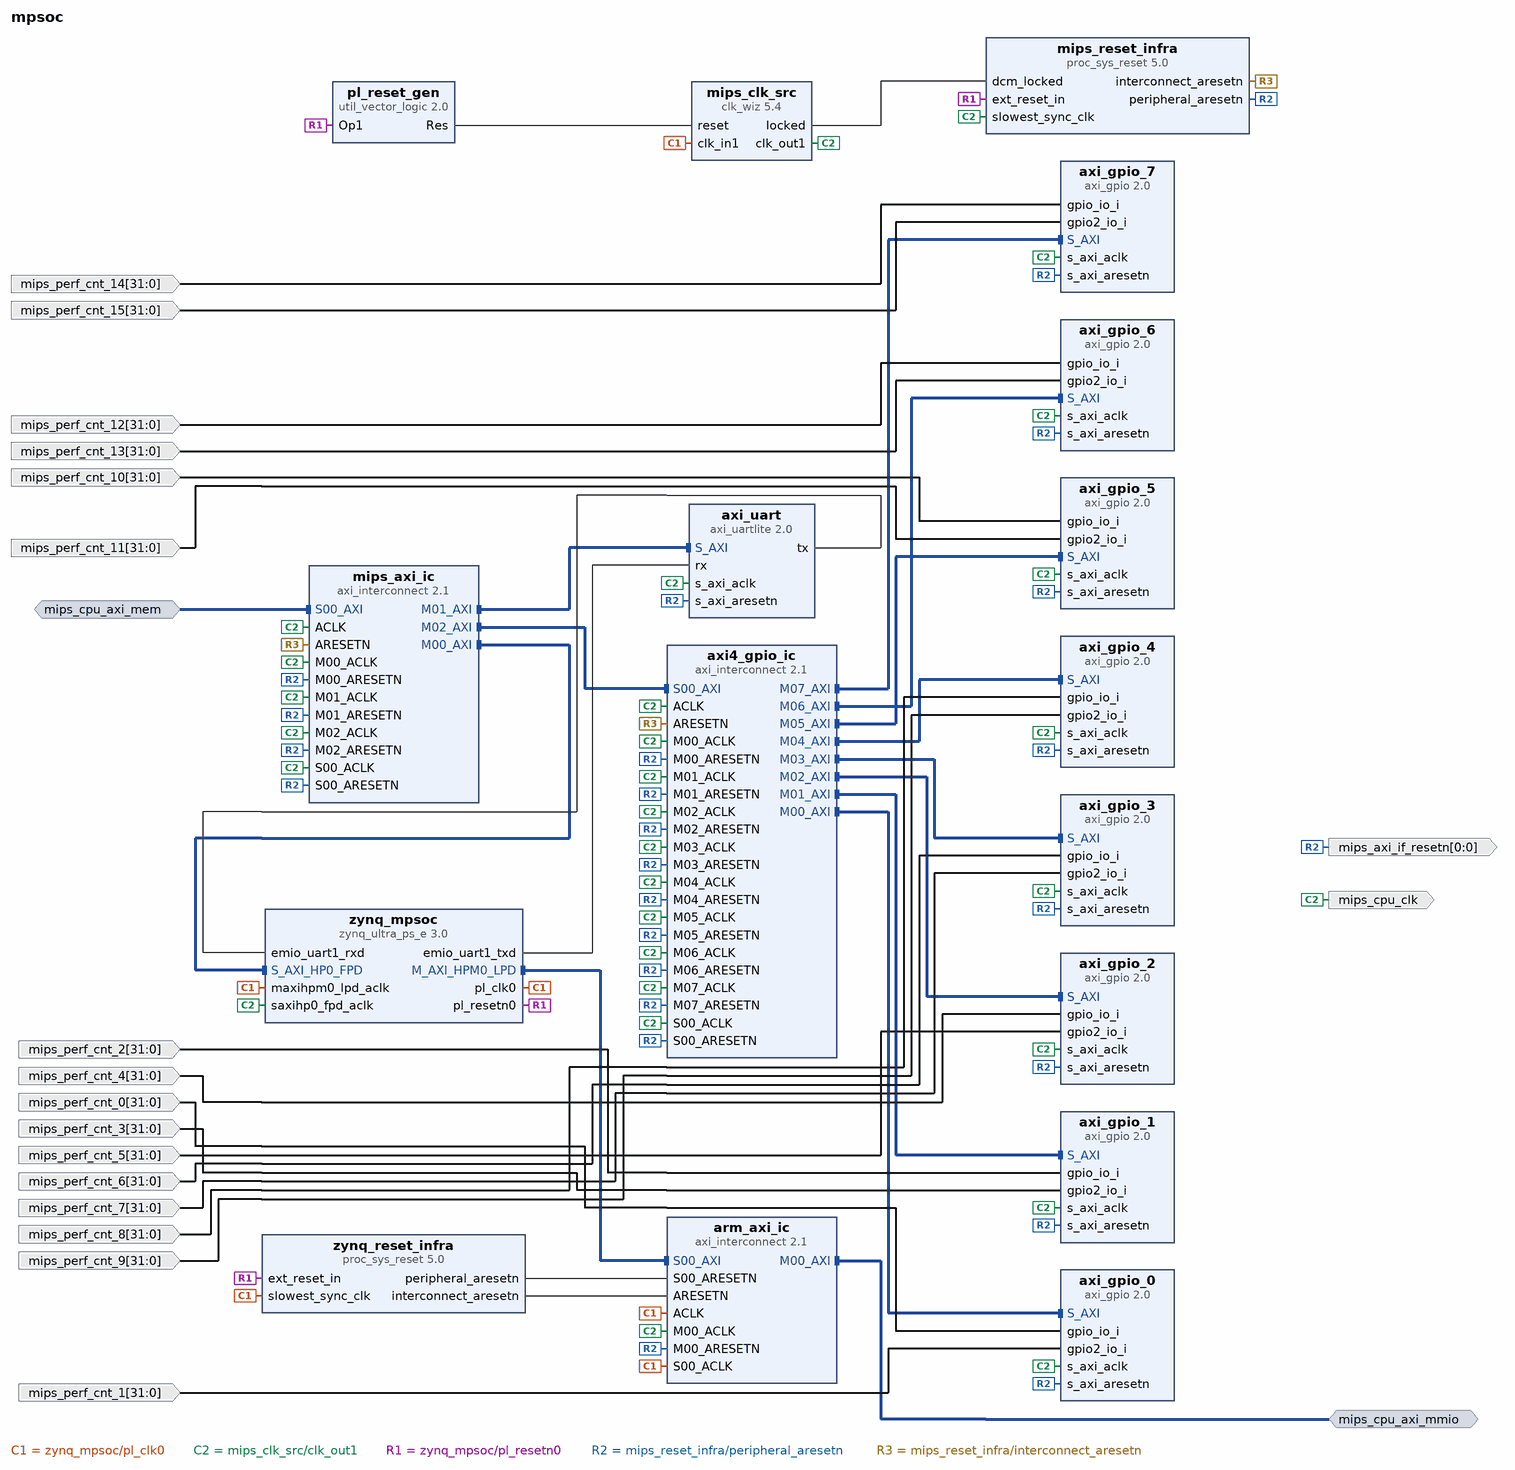
[diagram p0: block diagram of the top level]
# Vivado block design mpsoc, xczu2eg-sfva625-1-e, Vivado 2017.2
create_bd_design mpsoc

create_bd_intf_port -mode Master -vlnv xilinx.com:interface:aximm_rtl:1.0 mips_cpu_axi_mmio
set_property -dict {CONFIG.DATA_WIDTH 32 CONFIG.PROTOCOL AXI4LITE CONFIG.ADDR_WIDTH 32} [get_bd_intf_ports mips_cpu_axi_mmio]
create_bd_intf_port -mode Slave -vlnv xilinx.com:interface:aximm_rtl:1.0 mips_cpu_axi_mem
set_property -dict [list \
  CONFIG.DATA_WIDTH 32 \
  CONFIG.PROTOCOL AXI4LITE \
  CONFIG.ID_WIDTH 0 \
  CONFIG.ADDR_WIDTH 32 \
  CONFIG.AWUSER_WIDTH 0 \
  CONFIG.ARUSER_WIDTH 0 \
  CONFIG.WUSER_WIDTH 0 \
  CONFIG.RUSER_WIDTH 0 \
  CONFIG.BUSER_WIDTH 0 \
  CONFIG.READ_WRITE_MODE READ_WRITE \
  CONFIG.HAS_BURST 1 \
  CONFIG.HAS_LOCK 1 \
  CONFIG.HAS_PROT 1 \
  CONFIG.HAS_CACHE 1 \
  CONFIG.HAS_QOS 1 \
  CONFIG.HAS_REGION 1 \
  CONFIG.HAS_WSTRB 1 \
  CONFIG.HAS_BRESP 1 \
  CONFIG.HAS_RRESP 1 \
  CONFIG.SUPPORTS_NARROW_BURST 0 \
  CONFIG.NUM_READ_OUTSTANDING 1 \
  CONFIG.NUM_WRITE_OUTSTANDING 1 \
  CONFIG.MAX_BURST_LENGTH 1 \
  CONFIG.NUM_READ_THREADS 1 \
  CONFIG.NUM_WRITE_THREADS 1 \
  CONFIG.RUSER_BITS_PER_BYTE 0 \
  CONFIG.WUSER_BITS_PER_BYTE 0 \
] [get_bd_intf_ports mips_cpu_axi_mem]
create_bd_port -dir O -type clk mips_cpu_clk
set_property -dict {CONFIG.ASSOCIATED_BUSIF mips_cpu_axi_mmio:mips_cpu_axi_mem} [get_bd_ports mips_cpu_clk]
create_bd_port -dir O -from 0 -to 0 -type rst mips_axi_if_resetn
create_bd_port -dir I -from 31 -to 0 mips_perf_cnt_0
create_bd_port -dir I -from 31 -to 0 mips_perf_cnt_1
create_bd_port -dir I -from 31 -to 0 mips_perf_cnt_2
create_bd_port -dir I -from 31 -to 0 mips_perf_cnt_3
create_bd_port -dir I -from 31 -to 0 mips_perf_cnt_4
create_bd_port -dir I -from 31 -to 0 mips_perf_cnt_5
create_bd_port -dir I -from 31 -to 0 mips_perf_cnt_6
create_bd_port -dir I -from 31 -to 0 mips_perf_cnt_7
create_bd_port -dir I -from 31 -to 0 mips_perf_cnt_8
create_bd_port -dir I -from 31 -to 0 mips_perf_cnt_9
create_bd_port -dir I -from 31 -to 0 mips_perf_cnt_10
create_bd_port -dir I -from 31 -to 0 mips_perf_cnt_11
create_bd_port -dir I -from 31 -to 0 mips_perf_cnt_12
create_bd_port -dir I -from 31 -to 0 mips_perf_cnt_13
create_bd_port -dir I -from 31 -to 0 mips_perf_cnt_14
create_bd_port -dir I -from 31 -to 0 mips_perf_cnt_15

create_bd_cell -type ip -vlnv xilinx.com:ip:zynq_ultra_ps_e:3.0 zynq_mpsoc
set_property -dict [list \
  CONFIG.PSU__CAN1__PERIPHERAL__ENABLE 1 \
  CONFIG.PSU__CAN1__PERIPHERAL__IO {MIO 24 .. 25} \
  CONFIG.PSU__DPAUX__PERIPHERAL__IO {MIO 27 .. 30} \
  CONFIG.PSU__ENET3__PERIPHERAL__ENABLE 1 \
  CONFIG.PSU__ENET3__GRP_MDIO__ENABLE 1 \
  CONFIG.PSU__GPIO0_MIO__PERIPHERAL__ENABLE 1 \
  CONFIG.PSU__GPIO0_MIO__IO {MIO 0 .. 25} \
  CONFIG.PSU__GPIO1_MIO__PERIPHERAL__ENABLE 1 \
  CONFIG.PSU__GPIO1_MIO__IO {MIO 26 .. 51} \
  CONFIG.PSU__GPIO2_MIO__PERIPHERAL__ENABLE 1 \
  CONFIG.PSU__GPIO2_MIO__IO {MIO 52 .. 77} \
  CONFIG.PSU__I2C0__PERIPHERAL__ENABLE 1 \
  CONFIG.PSU__I2C0__PERIPHERAL__IO {MIO 14 .. 15} \
  CONFIG.PSU__I2C1__PERIPHERAL__ENABLE 1 \
  CONFIG.PSU__I2C1__PERIPHERAL__IO {MIO 16 .. 17} \
  CONFIG.PSU__PCIE__PERIPHERAL__ENABLE 1 \
  CONFIG.PSU__PCIE__PERIPHERAL__ROOTPORT_IO {MIO 31} \
  CONFIG.PSU__USB0__REF_CLK_SEL {Ref Clk2} \
  CONFIG.PSU__DP__REF_CLK_SEL {Ref Clk3} \
  CONFIG.PSU__SATA__REF_CLK_SEL {Ref Clk1} \
  CONFIG.PSU__SATA__REF_CLK_FREQ 125 \
  CONFIG.PSU__DP__LANE_SEL {Single Lower} \
  CONFIG.PSU__PCIE__DEVICE_PORT_TYPE {Root Port} \
  CONFIG.PSU__PCIE__DEVICE_ID 0xD021 \
  CONFIG.PSU__PCIE__CLASS_CODE_SUB 0x4 \
  CONFIG.PSU__QSPI__PERIPHERAL__ENABLE 1 \
  CONFIG.PSU__QSPI__PERIPHERAL__IO {MIO 0 .. 12} \
  CONFIG.PSU__QSPI__PERIPHERAL__MODE {Dual Parallel} \
  CONFIG.PSU__QSPI__PERIPHERAL__DATA_MODE x4 \
  CONFIG.PSU__QSPI__GRP_FBCLK__ENABLE 1 \
  CONFIG.PSU__SD1__PERIPHERAL__ENABLE 1 \
  CONFIG.PSU__SD1__PERIPHERAL__IO {MIO 46 .. 51} \
  CONFIG.PSU__SD1__GRP_CD__ENABLE 1 \
  CONFIG.PSU__SD1__GRP_CD__IO {MIO 45} \
  CONFIG.PSU__SD1__GRP_POW__ENABLE 0 \
  CONFIG.PSU__SD1__GRP_WP__ENABLE 1 \
  CONFIG.PSU__SD1__SLOT_TYPE {SD 2.0} \
  CONFIG.PSU__SD1__DATA_TRANSFER_MODE 4Bit \
  CONFIG.PSU__UART0__BAUD_RATE 115200 \
  CONFIG.PSU__TTC0__PERIPHERAL__ENABLE 1 \
  CONFIG.PSU__TTC1__PERIPHERAL__ENABLE 1 \
  CONFIG.PSU__TTC2__PERIPHERAL__ENABLE 1 \
  CONFIG.PSU__TTC3__PERIPHERAL__ENABLE 1 \
  CONFIG.PSU__CSUPMU__PERIPHERAL__VALID 0 \
  CONFIG.PSU__DDRC__DEVICE_CAPACITY {8192 MBits} \
  CONFIG.PSU__DDRC__DRAM_WIDTH {16 Bits} \
  CONFIG.PSU__DDRC__SPEED_BIN DDR4_2133P \
  CONFIG.PSU__UART0__PERIPHERAL__ENABLE 1 \
  CONFIG.PSU__UART0__PERIPHERAL__IO {MIO 34 .. 35} \
  CONFIG.PSU__UART1__PERIPHERAL__ENABLE 1 \
  CONFIG.PSU__UART1__PERIPHERAL__IO EMIO \
  CONFIG.PSU__USB0__PERIPHERAL__ENABLE 1 \
  CONFIG.PSU__USB3_0__PERIPHERAL__ENABLE 1 \
  CONFIG.PSU__USB3_0__PERIPHERAL__IO {GT Lane2} \
  CONFIG.PSU__USB2_0__EMIO__ENABLE 0 \
  CONFIG.PSU__USE__S_AXI_GP2 1 \
  CONFIG.PSU__SAXIGP2__DATA_WIDTH 64 \
  CONFIG.PSU_BANK_0_IO_STANDARD LVCMOS18 \
  CONFIG.PSU_BANK_2_IO_STANDARD LVCMOS18 \
  CONFIG.PSU_BANK_3_IO_STANDARD LVCMOS33 \
  CONFIG.PSU__DISPLAYPORT__PERIPHERAL__ENABLE 1 \
  CONFIG.PSU__SATA__PERIPHERAL__ENABLE 1 \
  CONFIG.PSU__SATA__LANE1__IO {GT Lane3} \
  CONFIG.PSU__CRF_APB__DP_VIDEO_REF_CTRL__SRCSEL VPLL \
  CONFIG.PSU__CRF_APB__DP_AUDIO_REF_CTRL__SRCSEL RPLL \
  CONFIG.PSU__CRF_APB__DP_STC_REF_CTRL__SRCSEL RPLL \
  CONFIG.PSU__CRF_APB__GPU_REF_CTRL__SRCSEL IOPLL \
  CONFIG.PSU__CRF_APB__GDMA_REF_CTRL__SRCSEL APLL \
  CONFIG.PSU__CRF_APB__DPDMA_REF_CTRL__SRCSEL APLL \
  CONFIG.PSU__CRF_APB__TOPSW_MAIN_CTRL__SRCSEL DPLL \
  CONFIG.PSU__CRL_APB__IOU_SWITCH_CTRL__SRCSEL IOPLL \
  CONFIG.PSU__CRL_APB__TIMESTAMP_REF_CTRL__SRCSEL IOPLL \
  CONFIG.PSU__DLL__ISUSED 1 \
  CONFIG.PSU__DDR__INTERFACE__FREQMHZ 533.500 \
  CONFIG.PSU__CRF_APB__ACPU_CTRL__FREQMHZ 1200 \
  CONFIG.PSU__CRF_APB__DDR_CTRL__FREQMHZ 1067 \
  CONFIG.PSU__CRF_APB__GPU_REF_CTRL__FREQMHZ 500 \
  CONFIG.PSU__CRF_APB__GDMA_REF_CTRL__FREQMHZ 600 \
  CONFIG.PSU__CRF_APB__DPDMA_REF_CTRL__FREQMHZ 600 \
  CONFIG.PSU__CRF_APB__TOPSW_MAIN_CTRL__FREQMHZ 533.33 \
  CONFIG.PSU__CRL_APB__QSPI_REF_CTRL__FREQMHZ 125 \
  CONFIG.PSU__CRL_APB__IOU_SWITCH_CTRL__FREQMHZ 250 \
  CONFIG.PSU__CRL_APB__AMS_REF_CTRL__FREQMHZ 52 \
] [get_bd_cells zynq_mpsoc]
# 26 more settings of zynq_mpsoc are not shown: defaults, MIO pin electricals, DDR timing, and values the tool derives
create_bd_cell -type ip -vlnv xilinx.com:ip:axi_interconnect:2.1 arm_axi_ic
set_property -dict {CONFIG.NUM_SI 1 CONFIG.NUM_MI 1} [get_bd_cells arm_axi_ic]
create_bd_cell -type ip -vlnv xilinx.com:ip:axi_interconnect:2.1 mips_axi_ic
set_property -dict {CONFIG.NUM_SI 1 CONFIG.NUM_MI 3} [get_bd_cells mips_axi_ic]
create_bd_cell -type ip -vlnv xilinx.com:ip:proc_sys_reset:5.0 zynq_reset_infra
create_bd_cell -type ip -vlnv xilinx.com:ip:proc_sys_reset:5.0 mips_reset_infra
create_bd_cell -type ip -vlnv xilinx.com:ip:clk_wiz:5.4 mips_clk_src
set_property -dict {CONFIG.JITTER_OPTIONS PS CONFIG.CLKOUT1_REQUESTED_OUT_FREQ 190} [get_bd_cells mips_clk_src]
create_bd_cell -type ip -vlnv xilinx.com:ip:axi_uartlite:2.0 axi_uart
set_property -dict {CONFIG.C_BAUDRATE 115200} [get_bd_cells axi_uart]
create_bd_cell -type ip -vlnv xilinx.com:ip:axi_gpio:2.0 axi_gpio_0
set_property -dict [list \
  CONFIG.C_GPIO_WIDTH 32 \
  CONFIG.C_GPIO2_WIDTH 32 \
  CONFIG.C_IS_DUAL 1 \
  CONFIG.C_ALL_INPUTS 1 \
  CONFIG.C_ALL_INPUTS_2 1 \
] [get_bd_cells axi_gpio_0]
create_bd_cell -type ip -vlnv xilinx.com:ip:axi_gpio:2.0 axi_gpio_1
set_property -dict [list \
  CONFIG.C_GPIO_WIDTH 32 \
  CONFIG.C_GPIO2_WIDTH 32 \
  CONFIG.C_IS_DUAL 1 \
  CONFIG.C_ALL_INPUTS 1 \
  CONFIG.C_ALL_INPUTS_2 1 \
] [get_bd_cells axi_gpio_1]
create_bd_cell -type ip -vlnv xilinx.com:ip:axi_gpio:2.0 axi_gpio_2
set_property -dict [list \
  CONFIG.C_GPIO_WIDTH 32 \
  CONFIG.C_GPIO2_WIDTH 32 \
  CONFIG.C_IS_DUAL 1 \
  CONFIG.C_ALL_INPUTS 1 \
  CONFIG.C_ALL_INPUTS_2 1 \
] [get_bd_cells axi_gpio_2]
create_bd_cell -type ip -vlnv xilinx.com:ip:axi_gpio:2.0 axi_gpio_3
set_property -dict [list \
  CONFIG.C_GPIO_WIDTH 32 \
  CONFIG.C_GPIO2_WIDTH 32 \
  CONFIG.C_IS_DUAL 1 \
  CONFIG.C_ALL_INPUTS 1 \
  CONFIG.C_ALL_INPUTS_2 1 \
] [get_bd_cells axi_gpio_3]
create_bd_cell -type ip -vlnv xilinx.com:ip:axi_gpio:2.0 axi_gpio_4
set_property -dict [list \
  CONFIG.C_GPIO_WIDTH 32 \
  CONFIG.C_GPIO2_WIDTH 32 \
  CONFIG.C_IS_DUAL 1 \
  CONFIG.C_ALL_INPUTS 1 \
  CONFIG.C_ALL_INPUTS_2 1 \
] [get_bd_cells axi_gpio_4]
create_bd_cell -type ip -vlnv xilinx.com:ip:axi_gpio:2.0 axi_gpio_5
set_property -dict [list \
  CONFIG.C_GPIO_WIDTH 32 \
  CONFIG.C_GPIO2_WIDTH 32 \
  CONFIG.C_IS_DUAL 1 \
  CONFIG.C_ALL_INPUTS 1 \
  CONFIG.C_ALL_INPUTS_2 1 \
] [get_bd_cells axi_gpio_5]
create_bd_cell -type ip -vlnv xilinx.com:ip:axi_gpio:2.0 axi_gpio_6
set_property -dict [list \
  CONFIG.C_GPIO_WIDTH 32 \
  CONFIG.C_GPIO2_WIDTH 32 \
  CONFIG.C_IS_DUAL 1 \
  CONFIG.C_ALL_INPUTS 1 \
  CONFIG.C_ALL_INPUTS_2 1 \
] [get_bd_cells axi_gpio_6]
create_bd_cell -type ip -vlnv xilinx.com:ip:axi_gpio:2.0 axi_gpio_7
set_property -dict [list \
  CONFIG.C_GPIO_WIDTH 32 \
  CONFIG.C_GPIO2_WIDTH 32 \
  CONFIG.C_IS_DUAL 1 \
  CONFIG.C_ALL_INPUTS 1 \
  CONFIG.C_ALL_INPUTS_2 1 \
] [get_bd_cells axi_gpio_7]
create_bd_cell -type ip -vlnv xilinx.com:ip:axi_interconnect:2.1 axi4_gpio_ic
set_property -dict {CONFIG.NUM_SI 1 CONFIG.NUM_MI 8} [get_bd_cells axi4_gpio_ic]
create_bd_cell -type ip -vlnv xilinx.com:ip:util_vector_logic:2.0 pl_reset_gen
set_property -dict {CONFIG.C_SIZE 1 CONFIG.C_OPERATION not} [get_bd_cells pl_reset_gen]

# ---- connections ----

connect_bd_intf_net -intf_net armv8_ps_M_AXI_GP0 [get_bd_intf_pins arm_axi_ic/S00_AXI] [get_bd_intf_pins zynq_mpsoc/M_AXI_HPM0_LPD]
connect_bd_intf_net -intf_net axi_ddr_if [get_bd_intf_pins mips_axi_ic/M00_AXI] [get_bd_intf_pins zynq_mpsoc/S_AXI_HP0_FPD]
connect_bd_intf_net [get_bd_intf_pins mips_axi_ic/M01_AXI] [get_bd_intf_pins axi_uart/S_AXI]
connect_bd_intf_net -intf_net axi_gpio_ic_s [get_bd_intf_pins mips_axi_ic/M02_AXI] [get_bd_intf_pins axi4_gpio_ic/S00_AXI]
connect_bd_intf_net -intf_net axi_gpio_ic_m_0 [get_bd_intf_pins axi4_gpio_ic/M00_AXI] [get_bd_intf_pins axi_gpio_0/S_AXI]
connect_bd_intf_net -intf_net axi_gpio_ic_m_1 [get_bd_intf_pins axi4_gpio_ic/M01_AXI] [get_bd_intf_pins axi_gpio_1/S_AXI]
connect_bd_intf_net -intf_net axi_gpio_ic_m_2 [get_bd_intf_pins axi4_gpio_ic/M02_AXI] [get_bd_intf_pins axi_gpio_2/S_AXI]
connect_bd_intf_net -intf_net axi_gpio_ic_m_3 [get_bd_intf_pins axi4_gpio_ic/M03_AXI] [get_bd_intf_pins axi_gpio_3/S_AXI]
connect_bd_intf_net -intf_net axi_gpio_ic_m_4 [get_bd_intf_pins axi4_gpio_ic/M04_AXI] [get_bd_intf_pins axi_gpio_4/S_AXI]
connect_bd_intf_net -intf_net axi_gpio_ic_m_5 [get_bd_intf_pins axi4_gpio_ic/M05_AXI] [get_bd_intf_pins axi_gpio_5/S_AXI]
connect_bd_intf_net -intf_net axi_gpio_ic_m_6 [get_bd_intf_pins axi4_gpio_ic/M06_AXI] [get_bd_intf_pins axi_gpio_6/S_AXI]
connect_bd_intf_net -intf_net axi_gpio_ic_m_7 [get_bd_intf_pins axi4_gpio_ic/M07_AXI] [get_bd_intf_pins axi_gpio_7/S_AXI]
connect_bd_intf_net -intf_net mips_cpu_slave [get_bd_intf_ports mips_cpu_axi_mmio] [get_bd_intf_pins arm_axi_ic/M00_AXI]
connect_bd_intf_net -intf_net mips_cpu_master [get_bd_intf_ports mips_cpu_axi_mem] [get_bd_intf_pins mips_axi_ic/S00_AXI]
connect_bd_net -net armv8_ps_fclk_0 [get_bd_pins zynq_mpsoc/pl_clk0] \
  [get_bd_pins mips_clk_src/clk_in1] [get_bd_pins zynq_mpsoc/maxihpm0_lpd_aclk] \
  [get_bd_pins zynq_reset_infra/slowest_sync_clk] [get_bd_pins arm_axi_ic/ACLK] [get_bd_pins arm_axi_ic/S00_ACLK]
connect_bd_net -net mips_clk [get_bd_pins mips_clk_src/clk_out1] \
  [get_bd_ports mips_cpu_clk] [get_bd_pins zynq_mpsoc/saxihp0_fpd_aclk] [get_bd_pins arm_axi_ic/M00_ACLK] \
  [get_bd_pins mips_axi_ic/S00_ACLK] [get_bd_pins mips_axi_ic/M00_ACLK] [get_bd_pins mips_axi_ic/M01_ACLK] \
  [get_bd_pins mips_axi_ic/M02_ACLK] [get_bd_pins mips_axi_ic/ACLK] [get_bd_pins axi_uart/s_axi_aclk] \
  [get_bd_pins mips_reset_infra/slowest_sync_clk] [get_bd_pins axi4_gpio_ic/ACLK] [get_bd_pins axi4_gpio_ic/M00_ACLK] \
  [get_bd_pins axi4_gpio_ic/M01_ACLK] [get_bd_pins axi4_gpio_ic/M02_ACLK] [get_bd_pins axi4_gpio_ic/M03_ACLK] \
  [get_bd_pins axi4_gpio_ic/M04_ACLK] [get_bd_pins axi4_gpio_ic/M05_ACLK] [get_bd_pins axi4_gpio_ic/M06_ACLK] \
  [get_bd_pins axi4_gpio_ic/M07_ACLK] [get_bd_pins axi4_gpio_ic/S00_ACLK] [get_bd_pins axi_gpio_0/s_axi_aclk] \
  [get_bd_pins axi_gpio_1/s_axi_aclk] [get_bd_pins axi_gpio_2/s_axi_aclk] [get_bd_pins axi_gpio_3/s_axi_aclk] \
  [get_bd_pins axi_gpio_4/s_axi_aclk] [get_bd_pins axi_gpio_5/s_axi_aclk] [get_bd_pins axi_gpio_6/s_axi_aclk] \
  [get_bd_pins axi_gpio_7/s_axi_aclk]
connect_bd_net -net ps_user_reset_n [get_bd_pins zynq_mpsoc/pl_resetn0] \
  [get_bd_pins zynq_reset_infra/ext_reset_in] [get_bd_pins mips_reset_infra/ext_reset_in] [get_bd_pins pl_reset_gen/Op1]
connect_bd_net -net pl_user_reset [get_bd_pins pl_reset_gen/Res] [get_bd_pins mips_clk_src/reset]
connect_bd_net -net zynq_perip_resetn [get_bd_pins zynq_reset_infra/peripheral_aresetn] [get_bd_pins arm_axi_ic/S00_ARESETN]
connect_bd_net -net zynq_ic_resetn [get_bd_pins zynq_reset_infra/interconnect_aresetn] [get_bd_pins arm_axi_ic/ARESETN]
connect_bd_net [get_bd_pins mips_clk_src/locked] [get_bd_pins mips_reset_infra/dcm_locked]
connect_bd_net -net mips_cpu_resetn [get_bd_pins mips_reset_infra/peripheral_aresetn] \
  [get_bd_pins mips_axi_ic/S00_ARESETN] [get_bd_pins mips_axi_ic/M00_ARESETN] [get_bd_pins mips_axi_ic/M01_ARESETN] \
  [get_bd_pins mips_axi_ic/M02_ARESETN] [get_bd_pins arm_axi_ic/M00_ARESETN] [get_bd_pins axi4_gpio_ic/M00_ARESETN] \
  [get_bd_pins axi4_gpio_ic/M01_ARESETN] [get_bd_pins axi4_gpio_ic/M02_ARESETN] [get_bd_pins axi4_gpio_ic/M03_ARESETN] \
  [get_bd_pins axi4_gpio_ic/M04_ARESETN] [get_bd_pins axi4_gpio_ic/M05_ARESETN] [get_bd_pins axi4_gpio_ic/M06_ARESETN] \
  [get_bd_pins axi4_gpio_ic/M07_ARESETN] [get_bd_pins axi4_gpio_ic/S00_ARESETN] [get_bd_pins axi_uart/s_axi_aresetn] \
  [get_bd_ports mips_axi_if_resetn] [get_bd_pins axi_gpio_0/s_axi_aresetn] [get_bd_pins axi_gpio_1/s_axi_aresetn] \
  [get_bd_pins axi_gpio_2/s_axi_aresetn] [get_bd_pins axi_gpio_3/s_axi_aresetn] [get_bd_pins axi_gpio_4/s_axi_aresetn] \
  [get_bd_pins axi_gpio_5/s_axi_aresetn] [get_bd_pins axi_gpio_6/s_axi_aresetn] [get_bd_pins axi_gpio_7/s_axi_aresetn]
connect_bd_net -net mips_ic_resetn [get_bd_pins mips_reset_infra/interconnect_aresetn] \
  [get_bd_pins mips_axi_ic/ARESETN] [get_bd_pins axi4_gpio_ic/ARESETN]
connect_bd_net -net uart_rx [get_bd_pins zynq_mpsoc/emio_uart1_txd] [get_bd_pins axi_uart/rx]
connect_bd_net -net uart_tx [get_bd_pins axi_uart/tx] [get_bd_pins zynq_mpsoc/emio_uart1_rxd]
connect_bd_net -net mips_perf_cnt_0_1 [get_bd_ports mips_perf_cnt_0] [get_bd_pins axi_gpio_0/gpio_io_i]
connect_bd_net -net mips_perf_cnt_1_1 [get_bd_ports mips_perf_cnt_1] [get_bd_pins axi_gpio_0/gpio2_io_i]
connect_bd_net -net mips_perf_cnt_2_1 [get_bd_ports mips_perf_cnt_2] [get_bd_pins axi_gpio_1/gpio_io_i]
connect_bd_net -net mips_perf_cnt_3_1 [get_bd_ports mips_perf_cnt_3] [get_bd_pins axi_gpio_1/gpio2_io_i]
connect_bd_net -net mips_perf_cnt_4_1 [get_bd_ports mips_perf_cnt_4] [get_bd_pins axi_gpio_2/gpio_io_i]
connect_bd_net -net mips_perf_cnt_5_1 [get_bd_ports mips_perf_cnt_5] [get_bd_pins axi_gpio_2/gpio2_io_i]
connect_bd_net -net mips_perf_cnt_6_1 [get_bd_ports mips_perf_cnt_6] [get_bd_pins axi_gpio_3/gpio_io_i]
connect_bd_net -net mips_perf_cnt_7_1 [get_bd_ports mips_perf_cnt_7] [get_bd_pins axi_gpio_3/gpio2_io_i]
connect_bd_net -net mips_perf_cnt_8_1 [get_bd_ports mips_perf_cnt_8] [get_bd_pins axi_gpio_4/gpio_io_i]
connect_bd_net -net mips_perf_cnt_9_1 [get_bd_ports mips_perf_cnt_9] [get_bd_pins axi_gpio_4/gpio2_io_i]
connect_bd_net -net mips_perf_cnt_10_1 [get_bd_ports mips_perf_cnt_10] [get_bd_pins axi_gpio_5/gpio_io_i]
connect_bd_net -net mips_perf_cnt_11_1 [get_bd_ports mips_perf_cnt_11] [get_bd_pins axi_gpio_5/gpio2_io_i]
connect_bd_net -net mips_perf_cnt_12_1 [get_bd_ports mips_perf_cnt_12] [get_bd_pins axi_gpio_6/gpio_io_i]
connect_bd_net -net mips_perf_cnt_13_1 [get_bd_ports mips_perf_cnt_13] [get_bd_pins axi_gpio_6/gpio2_io_i]
connect_bd_net -net mips_perf_cnt_14_1 [get_bd_ports mips_perf_cnt_14] [get_bd_pins axi_gpio_7/gpio_io_i]
connect_bd_net -net mips_perf_cnt_15_1 [get_bd_ports mips_perf_cnt_15] [get_bd_pins axi_gpio_7/gpio2_io_i]

# ---- address map ----
assign_bd_address -offset 0x40000000 -range 1G -target_address_space [get_bd_addr_spaces mips_cpu_axi_mem] [get_bd_addr_segs zynq_mpsoc/SAXIGP2/HP0_DDR_LOW]
assign_bd_address -offset 0x80010000 -range 4K -target_address_space [get_bd_addr_spaces mips_cpu_axi_mem] [get_bd_addr_segs axi_uart/S_AXI/Reg]
assign_bd_address -offset 0x80020000 -range 4K -target_address_space [get_bd_addr_spaces mips_cpu_axi_mem] [get_bd_addr_segs axi_gpio_0/S_AXI/Reg]
assign_bd_address -offset 0x80021000 -range 4K -target_address_space [get_bd_addr_spaces mips_cpu_axi_mem] [get_bd_addr_segs axi_gpio_1/S_AXI/Reg]
assign_bd_address -offset 0x80022000 -range 4K -target_address_space [get_bd_addr_spaces mips_cpu_axi_mem] [get_bd_addr_segs axi_gpio_2/S_AXI/Reg]
assign_bd_address -offset 0x80023000 -range 4K -target_address_space [get_bd_addr_spaces mips_cpu_axi_mem] [get_bd_addr_segs axi_gpio_3/S_AXI/Reg]
assign_bd_address -offset 0x80024000 -range 4K -target_address_space [get_bd_addr_spaces mips_cpu_axi_mem] [get_bd_addr_segs axi_gpio_4/S_AXI/Reg]
assign_bd_address -offset 0x80025000 -range 4K -target_address_space [get_bd_addr_spaces mips_cpu_axi_mem] [get_bd_addr_segs axi_gpio_5/S_AXI/Reg]
assign_bd_address -offset 0x80026000 -range 4K -target_address_space [get_bd_addr_spaces mips_cpu_axi_mem] [get_bd_addr_segs axi_gpio_6/S_AXI/Reg]
assign_bd_address -offset 0x80027000 -range 4K -target_address_space [get_bd_addr_spaces mips_cpu_axi_mem] [get_bd_addr_segs axi_gpio_7/S_AXI/Reg]
assign_bd_address -offset 0x00080020000 -range 4K -target_address_space [get_bd_addr_spaces zynq_mpsoc/Data] [get_bd_addr_segs mips_cpu_axi_mmio/Reg]

validate_bd_design
save_bd_design
